# EAGLE design RcCarMainBoard (EAGLE 7.5.0)
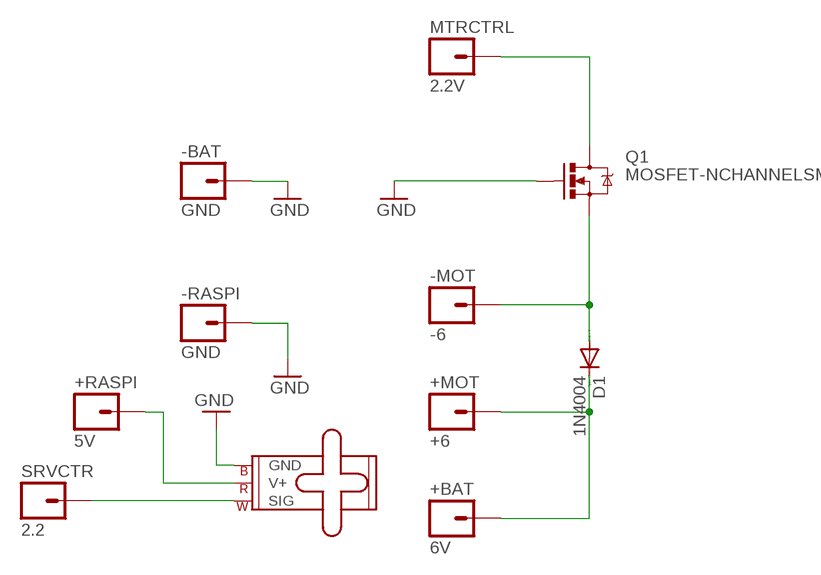
[diagram p0: schematic, sheet 1]

## Parts
+BAT  6V  M01PTH  [1X01]
+MOT  +6  M01PTH  [1X01]
+RASPI  5V  M01PTH  [1X01]
-BAT  GND  M01PTH  [1X01]
-MOT  -6  M01PTH  [1X01]
-RASPI  GND  M01PTH  [1X01]
D1  1N4004  [DO41-10]
M1  SMALL_SERVO  [1X03]
MTRCTRL  2.2V  M01PTH  [1X01]
Q1  MOSFET-NCHANNELSMD  [SOT23-3]
SRVCTR  2.2  M01PTH  [1X01]

## Nets
GND: -BAT.1 -RASPI.1 M1.3(GND) Q1.1(G)
N$1: +BAT.1 +MOT.1 D1.C
N$2: -MOT.1 D1.A Q1.2(S)
N$3: M1.1(SIG) SRVCTR.1
N$4: MTRCTRL.1 Q1.3(D)
N$5: +RASPI.1 M1.2(V+)

## Library data of the parts
+BAT +MOT +RASPI -BAT -MOT -RASPI MTRCTRL SRVCTR = SparkFun-Connectors:M01: Header 1 Standard 1-pin 0.1" header. Use with straight break away headers (SKU : PRT-00116), right angle break away headers (PRT-00553), swiss pins (PRT-00743), machine pins (PRT-00117), and female headers (PRT-00115). SMTSO-256-ET is a "flush mount" nut for a 4-40 screw. The older package used to be too tight, and did not allow it to sit properly thru the drill hit. The latest (0.165DIA) fits nice and snug.
D1 = diode:1N4004: DIODE general purpose rectifier, 1 A
M1 = SparkFun-Electromechanical:SMALL_SERVO: Small servo motor This is the small servo used in the SIK. SKU: ROB-09065
Q1 = SparkFun:MOSFET-NCHANNEL

## Board
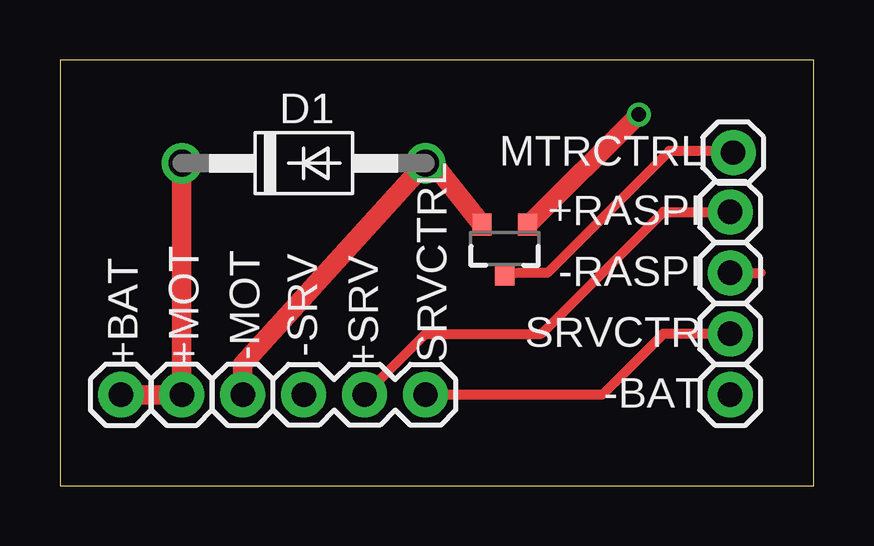
[diagram p1: board, top side]
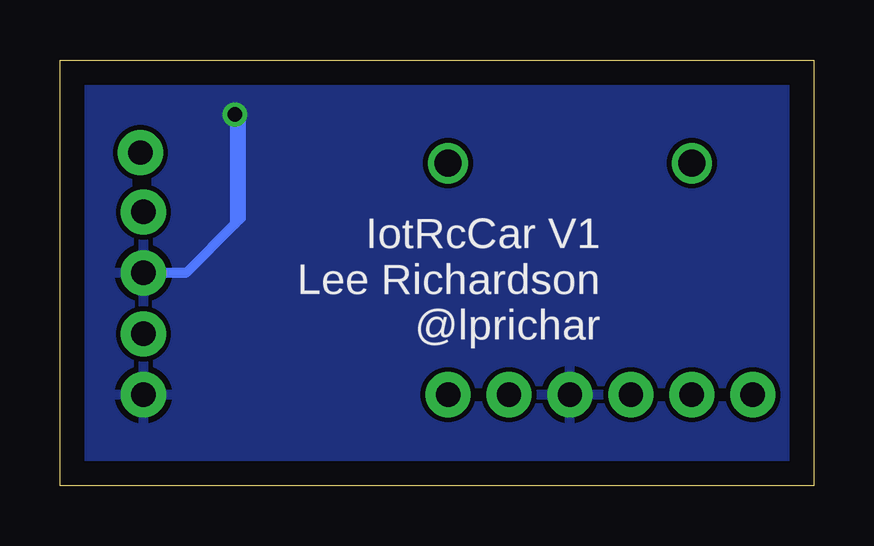
[diagram p2: board, bottom side, seen from below]

Size 31.42 x 17.77 mm. Coordinates in mm from the lower left corner, seen from the top.
Outline: 0,0 31.42,0 31.42,17.77 0,17.77 0,0
Copper layers (1*16): Top 0.035mm / dielectric 1.5mm / Bottom 0.035mm
Design rules "default": minimum track width 10mil, minimum drill 24mil, track to track 8mil, track to pad 8mil, pad to pad 8mil, via to via 8mil, smd to smd 8mil, copper to edge 40mil, drill to drill 8mil, minimum pad ring 10mil, minimum via ring 8mil, stop-mask expansion 4mil, vias tented up to drill 0mil, thermal gap 10mil

### Footprints (pad centres in the part's own frame; a part is rotated, then mirrored left to right if it is on the bottom)
1X01 = drill 1.016 pad 1.88: 1 0,0
DO41-10 = drill 1.118: A 5.08,0; C -5.08,0
1X03 = drill 1.016 pad 1.88: 1 0,0; 2 2.54,0; 3 5.08,0
SOT23-3 = smd 0.8 x 0.9: 1 -0.95,-1; 2 0.95,-1; 3 0,1.1

### Placement (x,y rotation side)
+BAT  2.54,3.81 0 top
+MOT  5.08,3.81 0 top
+RASPI  27.94,11.43 180 top
-BAT  27.94,3.81 0 top
-MOT  7.62,3.81 0 top
-RASPI  27.94,8.89 90 top
D1  10.16,13.46 0 top
M1  15.24,3.81 180 top
MTRCTRL  28.07,13.91 90 top
Q1  18.54,9.91 180 top
SRVCTR  27.94,6.35 90 top

### Tracks (layer width: path | path; a pad name or v marks a point on that pad's centre or on a via)
GND  (via drill 0.6)
  Top 0.406: -RASPI.1 29.21,8.89 | Q1.1 19.49,10.86
  Top 0.813: 19.49,10.86 v24.13,15.49
  Bottom 0.406: 24.13,10.92 23.88,11.18 23.88,15.24 v24.13,15.49 24.13,10.92 | 24.13,10.92 26.16,8.89 -RASPI.1
  pour Bottom: -1.27,17.78 -1.27,-1.27 33.02,-1.27 33.02,17.78
N$1
  Top 0.813: +BAT.1 +MOT.1 D1.C
N$2
  Top 0.406: D1.A 15.54,13.46
  Top 0.813: -MOT.1 7.62,5.08 D1.A | 15.54,13.46 Q1.2
N$3
  Top 0.406: SRVCTR.1 25.15,6.35 22.61,3.81 M1.1
N$4
  Top 0.406: MTRCTRL.1 28,13.97 25.4,13.97 20.32,8.89 19.13,8.89 Q1.3
N$5
  Top 0.406: M1.2 15.24,6.35 20.07,6.35 25.15,11.43 +RASPI.1

### Text on the board
bPlace: IotRcCar V1 / Lee Richardson / @lprichar
tNames: -SRV | +SRV | SRVCTRL